# EAGLE schematic schematic (EAGLE 8.5.2)
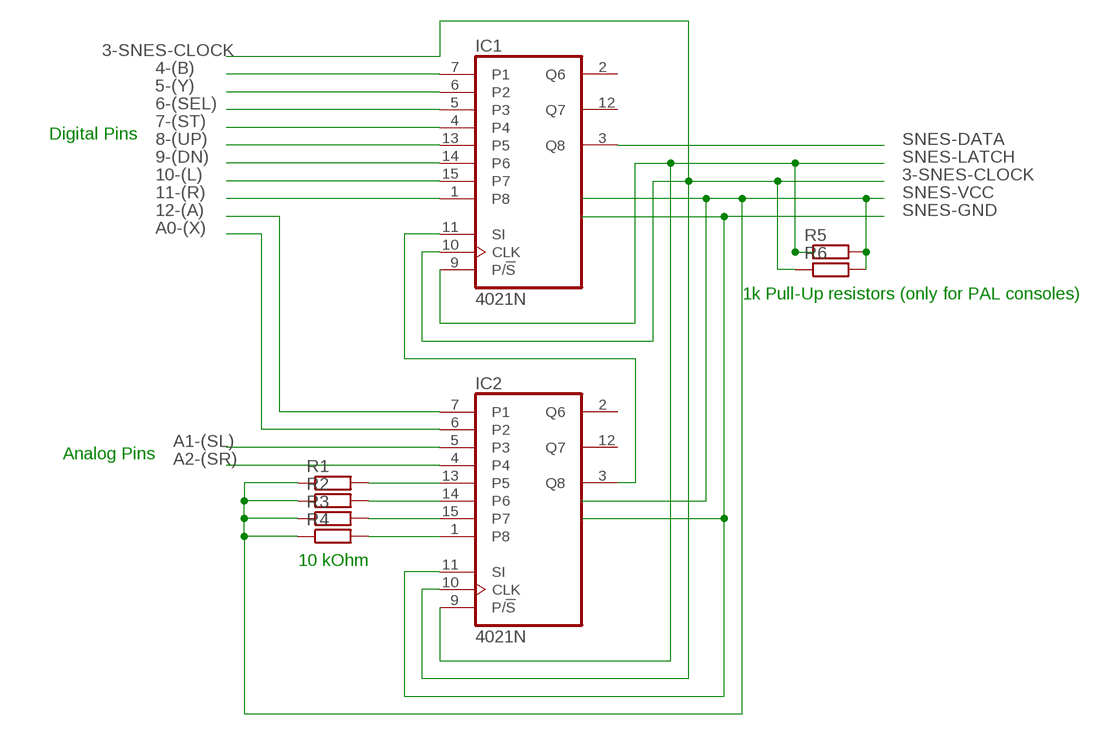
[diagram p0: schematic, sheet 1]

## Parts
IC1  4021N  [DIL16]
IC2  4021N  [DIL16]
R1  R-EU_0204/2V  [0204V]
R2  R-EU_0204/2V  [0204V]
R3  R-EU_0204/2V  [0204V]
R4  R-EU_0204/2V  [0204V]
R5  R-EU_0204/2V  [0204V]
R6  R-EU_0204/2V  [0204V]

## Nets
3-SNES-CLOCK: IC1.10(CLK) IC2.10(CLK) R6.1
4-(B): IC1.7(P1)
12-(A): IC2.7(P1)
A1-(SL): IC2.5(P3)
A2-(SR): IC2.4
N$1: IC2.13(P5) R1.2
N$2: IC2.14(P6) R2.2
N$3: IC2.15(P7) R3.2
N$4: IC2.1(P8) R4.2
N$7: IC1.11(SI) IC2.3(Q8)
SNES-DATA: IC1.3(Q8)
SNES-GND: IC2.11(SI)
SNES-LATCH: IC1.9(P/!S) IC2.9(P/!S) R5.1
SNES-VCC: R1.1 R2.1 R3.1 R4.1 R5.2 R6.2
Unconnected: IC1.1(P8) IC1.2(Q6) IC1.4 IC1.5(P3) IC1.6(P2) IC1.12(Q7) IC1.13(P5) IC1.14(P6) IC1.15(P7) IC2.2(Q6) IC2.6(P2) IC2.12(Q7)

## Notes on the sheet
- Digital Pins
- 1k Pull-Up resistors (only for PAL consoles)
- Analog Pins
- 10 kOhm

## Power pins joined to a net without a drawn wire
VDD: IC1.16(VDD) IC2.16(VDD)
VSS: IC1.8(VSS) IC2.8(VSS)

## Library data of the parts
IC1 IC2 = 40xx:4021: 8-bit static SHIFT REGISTER
R1-R6 = rcl:R-EU_: RESISTOR, European symbol; SPICEPREFIX: R